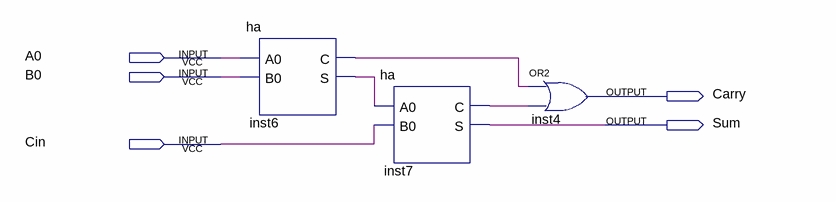
[diagram p0: schematic sheet]
// Quartus schematic fa_with_ha.bdf as structural Verilog: 3 symbols, 5 pins
module fa_with_ha (
  input  A0,
  input  B0,
  input  Cin,
  output Carry,
  output Sum
);

  wire inst6_c, inst6_s, inst7_c;

  ha inst6 (.A0(A0), .B0(B0), .C(inst6_c), .S(inst6_s));
  ha inst7 (.A0(inst6_s), .B0(Cin), .C(inst7_c), .S(Sum));
  or inst4 (Carry, inst6_c, inst7_c);
endmodule
